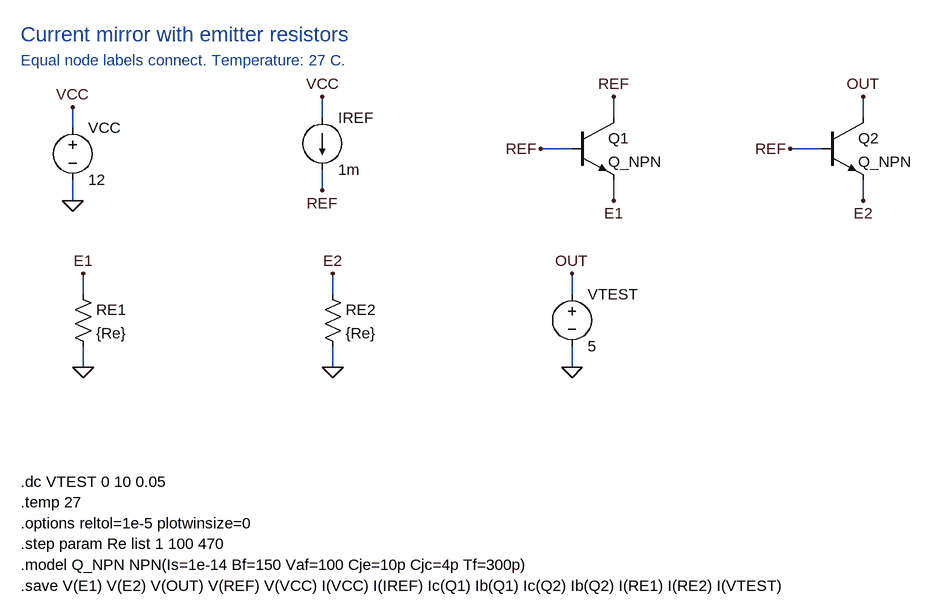
[diagram p0: schematic degenerated-current-mirror.asc]
degenerated-current-mirror.asc, the LTspice schematic file:
Version 4
SHEET 1 1740 1032
WIRE 144 176 144 144
WIRE 144 256 144 288
WIRE 528 160 528 128
WIRE 528 240 528 272
WIRE 976 160 976 128
WIRE 912 208 864 208
WIRE 976 256 976 288
WIRE 1360 160 1360 128
WIRE 1296 208 1248 208
WIRE 1360 256 1360 288
WIRE 160 432 160 400
WIRE 160 512 160 544
WIRE 544 432 544 400
WIRE 544 512 544 544
WIRE 912 432 912 400
WIRE 912 512 912 544
FLAG 144 144 VCC
FLAG 144 288 0
FLAG 528 128 VCC
FLAG 528 272 REF
FLAG 976 128 REF
FLAG 864 208 REF
FLAG 976 288 E1
FLAG 1360 128 OUT
FLAG 1248 208 REF
FLAG 1360 288 E2
FLAG 160 400 E1
FLAG 160 544 0
FLAG 544 400 E2
FLAG 544 544 0
FLAG 912 400 OUT
FLAG 912 544 0
SYMBOL voltage 144 160 R0
SYMATTR InstName VCC
SYMATTR Value 12
SYMBOL current 528 160 R0
SYMATTR InstName IREF
SYMATTR Value 1m
SYMBOL npn 912 160 R0
SYMATTR InstName Q1
SYMATTR Value Q_NPN
SYMBOL npn 1296 160 R0
SYMATTR InstName Q2
SYMATTR Value Q_NPN
SYMBOL res 144 416 R0
SYMATTR InstName RE1
SYMATTR Value {Re}
SYMBOL res 528 416 R0
SYMATTR InstName RE2
SYMATTR Value {Re}
SYMBOL voltage 912 416 R0
SYMATTR InstName VTEST
SYMATTR Value 5
TEXT 64 32 Left 3 ;Current mirror with emitter resistors
TEXT 64 72 Left 2 ;Equal node labels connect. Temperature: 27 C.
TEXT 64 720 Left 2 !.dc VTEST 0 10 0.05
TEXT 64 752 Left 2 !.temp 27
TEXT 64 784 Left 2 !.options reltol=1e-5 plotwinsize=0
TEXT 64 816 Left 2 !.step param Re list 1 100 470
TEXT 64 848 Left 2 !.model Q_NPN NPN(Is=1e-14 Bf=150 Vaf=100 Cje=10p Cjc=4p Tf=300p)
TEXT 64 880 Left 2 !.save V(E1) V(E2) V(OUT) V(REF) V(VCC) I(VCC) I(IREF) Ic(Q1) Ib(Q1) Ic(Q2) Ib(Q2) I(RE1) I(RE2) I(VTEST)

The netlist it stands for:
* degenerated-current-mirror.asc
VCC VCC 0 12
IREF VCC REF 1m
Q1 REF REF E1 0 Q_NPN
Q2 OUT REF E2 0 Q_NPN
RE1 E1 0 {Re}
RE2 E2 0 {Re}
VTEST OUT 0 5
.model NPN NPN
.model PNP PNP
.lib standard.bjt
* Current mirror with emitter resistors
* Equal node labels connect. Temperature: 27 C.
.dc VTEST 0 10 0.05
.temp 27
.options reltol=1e-5 plotwinsize=0
.step param Re list 1 100 470
.model Q_NPN NPN(Is=1e-14 Bf=150 Vaf=100 Cje=10p Cjc=4p Tf=300p)
.save V(E1) V(E2) V(OUT) V(REF) V(VCC) I(VCC) I(IREF) Ic(Q1) Ib(Q1) Ic(Q2) Ib(Q2) I(RE1) I(RE2) I(VTEST)
.backanno
.end